# EAGLE design motor_driver (EAGLE 9.3.2)
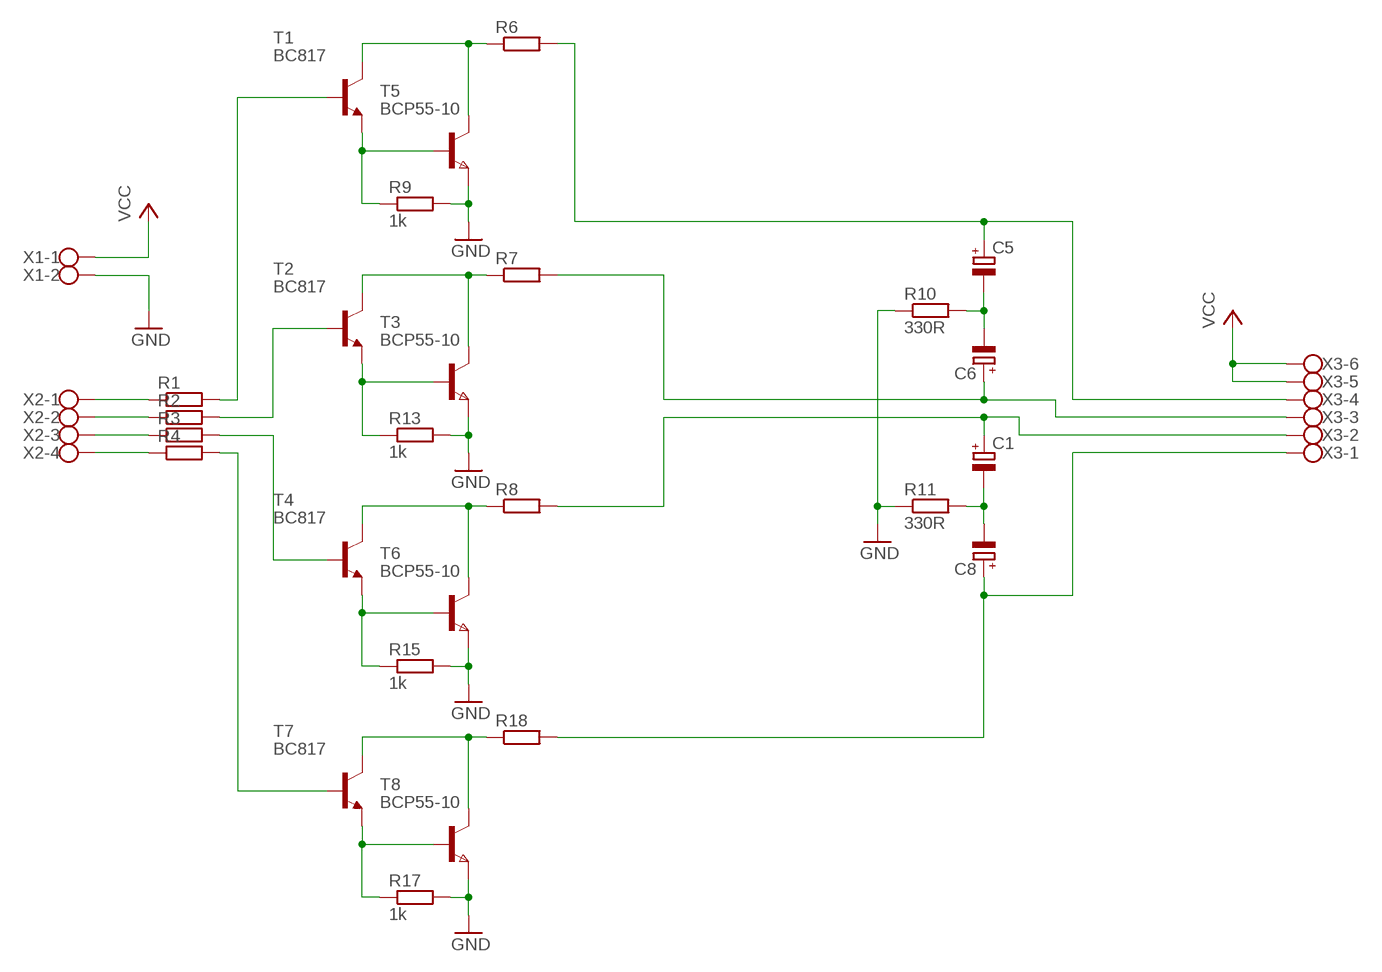
[diagram p0: schematic, sheet 1]

## Parts
C1  CPOL-EU153CLV-0807  [153CLV-0807]
C5  CPOL-EU153CLV-0807  [153CLV-0807]
C6  CPOL-EU153CLV-0807  [153CLV-0807]
C8  CPOL-EU153CLV-0807  [153CLV-0807]
R1  R-EU_M1206  [M1206]
R2  R-EU_M1206  [M1206]
R3  R-EU_M1206  [M1206]
R4  R-EU_M1206  [M1206]
R6  R-EU_0922/22  [0922/22]
R7  R-EU_0922/22  [0922/22]
R8  R-EU_0922/22  [0922/22]
R9  1k  R-EU_M1206  [M1206]
R10  330R  R-EU_M1206  [M1206]
R11  330R  R-EU_M1206  [M1206]
R13  1k  R-EU_M1206  [M1206]
R15  1k  R-EU_M1206  [M1206]
R17  1k  R-EU_M1206  [M1206]
R18  R-EU_0922/22  [0922/22]
T1  BC817  BC817-25-NPN-SOT23-BEC  [SOT23-BEC]
T2  BC817  BC817-25-NPN-SOT23-BEC  [SOT23-BEC]
T3  BCP55-10  NPNSOT223  [SOT223]
T4  BC817  BC817-25-NPN-SOT23-BEC  [SOT23-BEC]
T5  BCP55-10  NPNSOT223  [SOT223]
T6  BCP55-10  NPNSOT223  [SOT223]
T7  BC817  BC817-25-NPN-SOT23-BEC  [SOT23-BEC]
T8  BCP55-10  NPNSOT223  [SOT223]
X1  W237-102  [W237-102]
X2  W237-4  [W237-4]
X3  W237-6  [W237-6]

## Nets
GND: R9.2 R10.1 R11.1 R13.2 R15.2 R17.2 T3.3(E) T5.3(E) T6.3(E) T8.3(E) X1.2
N$1: R1.1 X2.1
N$2: R2.1 X2.2
N$3: R3.1 X2.3
N$4: R4.1 X2.4
N$5: R1.2 T1.B
N$6: C1.- C8.- R11.2
N$7: R9.1 T1.E T5.1(B)
N$8: R6.1 T1.C T5.2(C) T5.4(C)
N$11: C6.+ R7.2 X3.3
N$12: C5.+ R6.2 X3.4
N$13: C5.- C6.- R10.2
N$17: R2.2 T2.B
N$18: R13.1 T2.E T3.1(B)
N$19: R7.1 T2.C T3.2(C) T3.4(C)
N$21: R3.2 T4.B
N$22: R15.1 T4.E T6.1(B)
N$23: R8.1 T4.C T6.2(C) T6.4(C)
N$24: C1.+ R8.2 X3.2
N$25: R4.2 T7.B
N$26: R17.1 T7.E T8.1(B)
N$27: R18.1 T7.C T8.2(C) T8.4(C)
N$28: C8.+ R18.2 X3.1
VCC: X1.1 X3.5 X3.6

## Library data of the parts
C1 C5 C6 C8 = rcl:CPOL-EU: POLARIZED CAPACITOR, European symbol; SPICEPREFIX: C
R1-R4 R6-R11 R13 R15 R17 R18 = rcl:R-EU_: RESISTOR, European symbol; SPICEPREFIX: R
T1 T2 T4 T7 = transistor:*-NPN-: NPN Transistror BF959 corrected 2008.03.06
T3 T5 T6 T8 = zetex:NPNSOT223: NPN TRANSISTOR; MPN: DJT4031N-13; OC_FARNELL: 1710672; OC_NEWARK: 25R4490
X1 = con-wago-500:W237-102: WAGO SCREW CLAMP; MPN: 237-102; OC_FARNELL: unknown; OC_NEWARK: 70K9898
X2 = con-wago-500:W237-4: WAGO SCREW CLAMP; OC_FARNELL: unknown; OC_NEWARK: unknown
X3 = con-wago-500:W237-6: WAGO SCREW CLAMP; OC_FARNELL: unknown; OC_NEWARK: unknown

## Board
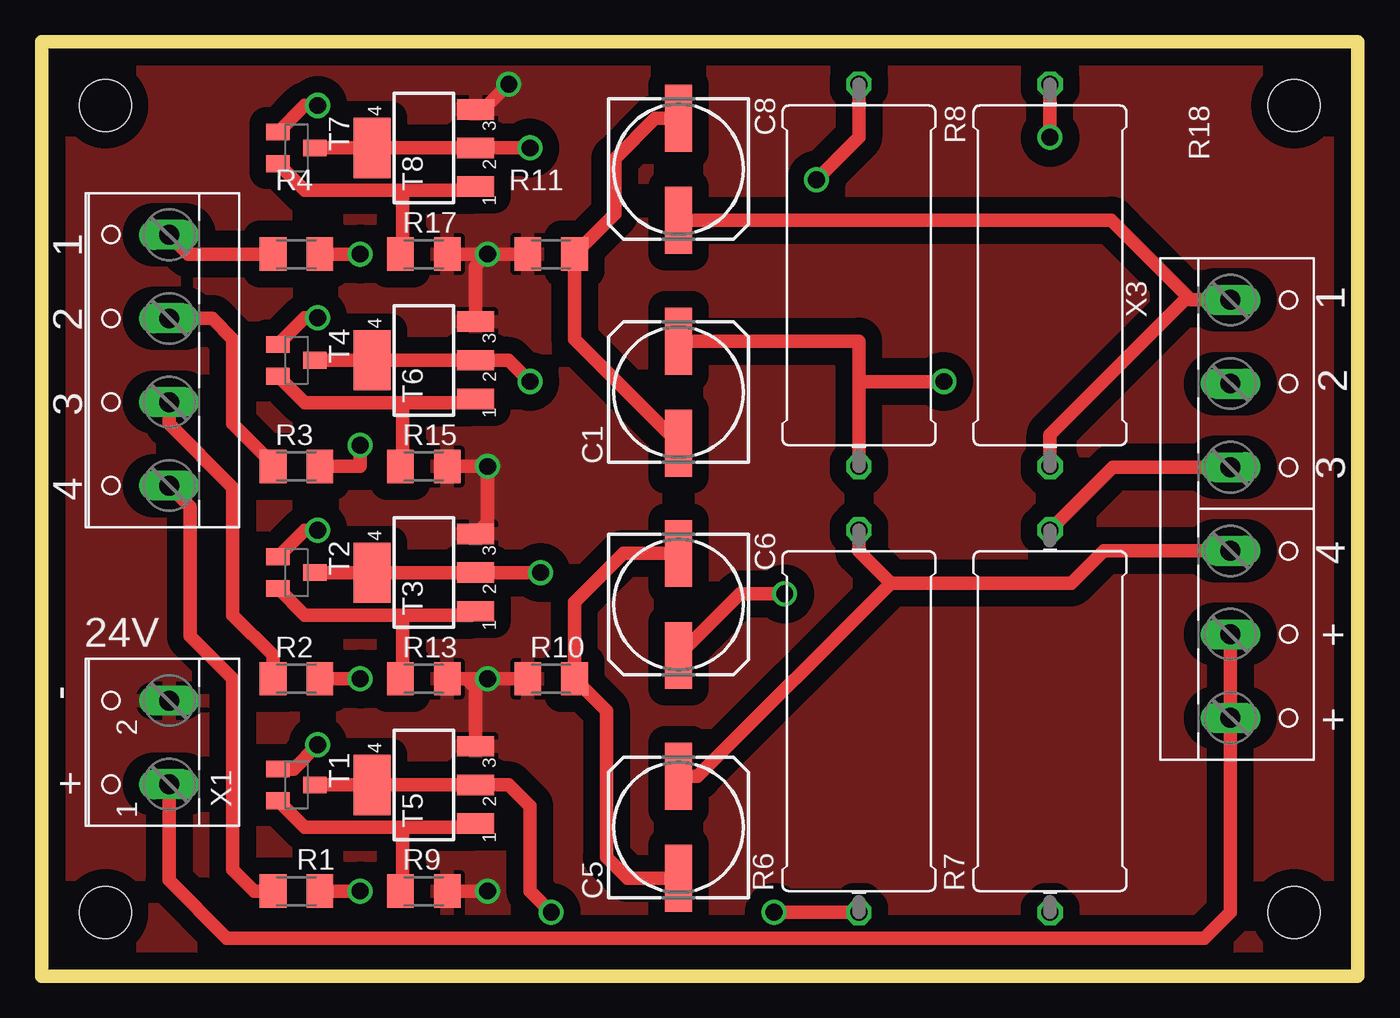
[diagram p1: board, top side]
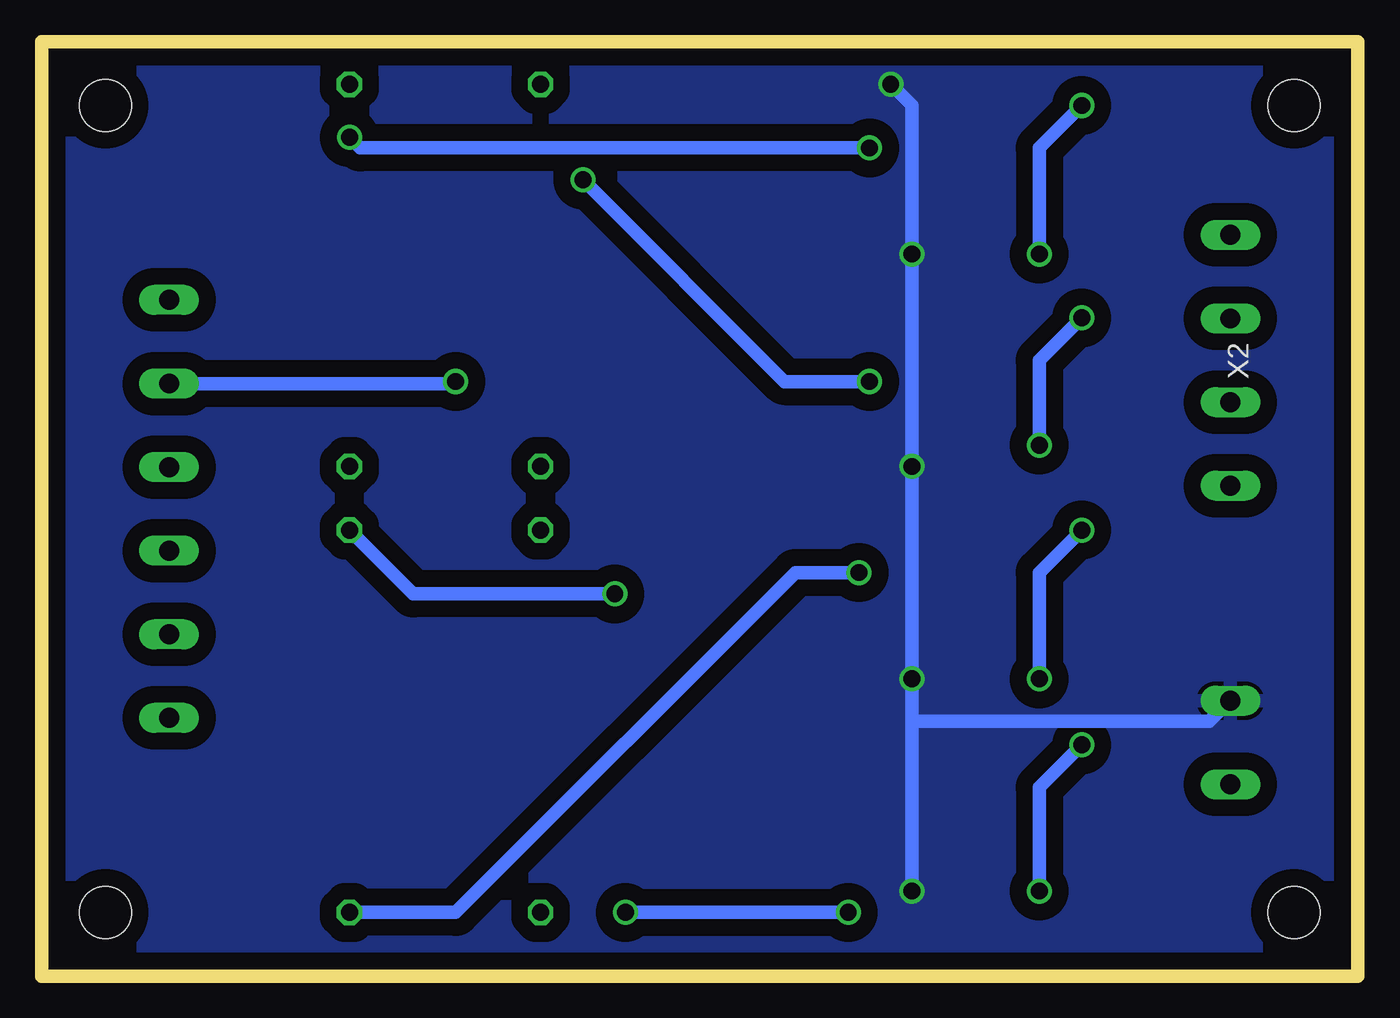
[diagram p2: board, bottom side, seen from below]

Size 78.74 x 55.88 mm. Coordinates in mm from the lower left corner, seen from the top.
Outline: 0,55.88 78.74,55.88 78.74,0 0,0 0,55.88
Copper layers (1*16): Top 0.035mm / dielectric 1.5mm / Bottom 0.035mm
Design rules "default": minimum track width 6mil, minimum drill 0.35mm, track to track 6mil, track to pad 6mil, pad to pad 6mil, via to via 6mil, smd to smd 6mil, copper to edge 40mil, drill to drill 6mil, minimum pad ring 10mil, minimum via ring 8mil, stop-mask expansion 4mil, vias tented up to drill 0mil, thermal gap 10mil
Holes 3.1 mm at 3.81,52.07 74.93,52.07 3.81,3.81 74.93,3.81

### Footprints (pad centres in the part's own frame; a part is rotated, then mirrored left to right if it is on the bottom)
153CLV-0807 = smd 4 x 1.6: + 3.05,0; - -3.05,0
M1206 = smd 1.6 x 2: 1 -1.4,0; 2 1.4,0
0922/22 = drill 1.016 octagon: 1 -11.43,0; 2 11.43,0
SOT23-BEC = smd 1 x 1.4: B -0.95,-1.1; C 0,1.1; E 0.95,-1.1
SOT223 = smd 1.219 x 2.235: 1 -2.311,-3.099; 2 0,-3.099; 3 2.311,-3.099 | smd 3.6 x 2.2: 4 0,3.099
W237-102 = drill 1.194 long: 1 -2.5,-1.27; 2 2.5,-1.27
W237-4 = drill 1.194 long: 1 -7.5,-1.27; 2 -2.5,-1.27; 3 2.5,-1.27; 4 7.5,-1.27
W237-6 = drill 1.194 long: 1 -12.5,-1.27; 2 -7.5,-1.27; 3 -2.5,-1.27; 4 2.5,-1.27; 5 7.5,-1.27; 6 12.5,-1.27

### Placement (x,y rotation side)
C1  38.1,34.92 90 top
C5  38.1,8.89 90 top
C6  38.1,22.23 270 top
C8  38.1,48.26 270 top
R1  15.24,5.08 0 top
R2  15.24,17.78 0 top
R3  15.24,30.48 0 top
R4  15.24,43.18 0 top
R6  48.9,15.24 90 top
R7  60.33,15.24 90 top
R8  48.9,41.91 270 top
R9  22.86,5.08 0 top
R10  30.48,17.78 0 top
R11  30.48,43.18 0 top
R13  22.86,17.78 0 top
R15  22.86,30.48 0 top
R17  22.86,43.18 0 top
R18  60.33,41.91 270 top
T1  15.24,11.43 270 top
T2  15.24,24.13 270 top
T3  22.86,24.13 90 top
T4  15.24,36.83 270 top
T5  22.86,11.43 90 top
T6  22.86,36.83 90 top
T7  15.24,49.53 270 top
T8  22.86,49.53 90 top
X1  6.35,13.97 90 top
X2  6.35,36.83 90 top
X3  72.39,27.94 270 top

### Tracks (layer width: path | path; a pad name or v marks a point on that pad's centre or on a via)
GND  (via drill 1)
  Top 0.813: R17.2 v26.67,43.18 | v26.67,43.18 R11.1 | T6.3 25.96,42.47 v26.67,43.18 | R10.1 v26.67,17.78 25.4,17.78 | 25.4,17.78 R13.2 | T5.3 25.96,17.22 25.4,17.78 | R9.2 v26.67,5.08 | R15.2 v26.67,30.48 26.67,27.15 T3.3 | v27.94,53.34 26.44,51.84 T8.3
  Bottom 0.813: v26.67,5.08 26.67,15.24 | 26.67,15.24 v26.67,17.78 v26.67,30.48 v26.67,43.18 26.67,52.07 v27.94,53.34 | X1.2 7.66,16.47 8.89,15.24 26.67,15.24
  pour Top (isolate 1): 0,55.88 78.74,55.88 78.74,0 0,0
  pour Bottom (isolate 1): 0,55.88 78.74,55.88 78.74,0 0,0
N$1
  Top 0.813: X2.1 8.89,28.06 8.89,20.32 11.43,17.78 11.43,6.35 12.7,5.08 R1.1
N$2
  Top 0.813: X2.2 7.62,33.02 11.43,29.21 11.43,21.59 13.84,19.18 R2.1
N$3
  Top 0.813: X2.3 10.2,39.33 11.43,38.1 11.43,33.02 13.84,30.61 R3.1
N$4
  Top 0.813: R4.1 8.77,43.18 X2.4
N$5  (via drill 1)
  Top 0.813: R1.2 v19.05,5.08 | T1.B 15.06,12.38 v16.51,13.83
  Bottom 0.813: v16.51,13.83 19.05,11.29 v19.05,5.08
N$6
  Top 0.813: 31.75,43.05 R11.2 | R11.2 34.29,45.59 34.29,48.9 36.7,51.31 C8.- | R11.2 31.88,38.09 C1.-
N$7
  Top 0.813: T1.E 15.73,8.89 21.59,8.89 | T5.1 25.73,8.89 21.59,8.89 | R9.1 21.59,5.21 21.59,8.89
N$8  (via drill 1)
  Top 0.813: T1.C T5.4 T5.2 27.94,11.43 29.21,10.16 29.21,5.08 v30.48,3.81 | R6.1 v43.81,3.81
  Bottom 0.813: v43.81,3.81 v30.48,3.81
N$11  (via drill 1)
  Top 0.813: X3.3 64.09,30.44 R7.2 | C6.+ 41.78,22.86 v44.45,22.86
  Bottom 0.813: v44.45,22.86 56.52,22.86 R7.2
N$12
  Top 0.813: X3.4 63.54,25.44 61.59,23.5 50.8,23.5 | 50.8,23.5 48.9,25.4 R6.2 | C5.+ 39.24,11.94 50.8,23.5
N$13
  Top 0.813: 31.75,17.78 R10.2 | 31.75,17.91 R10.2 | R10.2 31.88,22.36 34.8,25.27 C6.- | R10.2 33.78,15.88 33.78,7.12 35.06,5.84 C5.-
N$17  (via drill 1)
  Top 0.813: R2.2 v19.05,17.78 | T2.B 15.73,26.67 v16.51,26.67
  Bottom 0.813: v16.51,26.67 19.05,24.13 v19.05,17.78
N$18
  Top 0.813: T2.E 15.73,21.59 21.59,21.59 | T3.1 25.73,21.59 21.59,21.59 | R13.1 21.59,17.91 21.59,21.59
N$19  (via drill 1)
  Top 0.813: T2.C T3.4 T3.2 v29.84,24.13
  Bottom 0.813: v29.84,24.13 33.66,24.13 53.98,3.81 R7.1
N$21  (via drill 1)
  Top 0.813: v19.05,31.75 19.05,30.48 R3.2 | v16.51,39.37 15.73,39.37 T4.B
  Bottom 0.813: v16.51,39.37 19.05,36.83 v19.05,31.75
N$22
  Top 0.813: T4.E 15.73,34.29 21.59,34.29 | T6.1 25.73,34.29 21.59,34.29 | R15.1 21.59,30.61 21.59,34.29
N$23  (via drill 1)
  Top 0.813: T4.C T6.4 T6.2 27.94,36.83 v29.21,35.56 | R8.1 48.9,50.16 v46.35,47.62
  Bottom 0.813: v46.35,47.62 34.29,35.56 v29.21,35.56
N$24  (via drill 1)
  Top 0.813: C1.+ 48.9,37.98 48.9,35.56 | R8.2 48.9,35.56 | v53.98,35.56 48.9,35.56
  Bottom 0.813: v53.98,35.56 54.09,35.44 X3.2
N$25  (via drill 1)
  Top 0.813: v19.05,43.18 R4.2 | T7.B 15.73,52.07 v16.51,52.07
  Bottom 0.813: v16.51,52.07 19.05,49.53 v19.05,43.18
N$26
  Top 0.813: T7.E 15.73,46.99 21.59,46.99 | T8.1 25.73,46.99 21.59,46.99 | R17.1 21.59,43.31 21.59,46.99
N$27  (via drill 1)
  Top 0.813: T7.C T8.4 T8.2 v29.21,49.53 | v60.33,50.16 R18.1
  Bottom 0.813: v29.21,49.53 59.69,49.53 v60.33,50.16
N$28
  Top 0.813: R18.2 60.33,32.38 68.58,40.64 | 68.58,40.64 68.78,40.44 X3.1 | C8.+ 64.01,45.21 68.58,40.64
VCC
  Top 0.813: X1.1 7.62,5.71 11.07,2.26 69.57,2.26 71.12,3.81 X3.6 X3.5

### Text on the board
tPlace: 1 | 1 | 2 | 3 | 2 | 3 | 4 | 4 | 24V | + | - | + | +